# Altium schematic sheet 02.Revision History.SchDoc
size 297 x 209 mm; Revision: V2.1; Schematic Page Number: 11; Page Number: 3; Check: Default; Schematic Name: RK_NVR_DEMO1_RK3588_LP4/4x_V21; Page Count: 43; Page name: 02.Revision History; Designer: Zhangdz; Schematic Page Count: 99; Revcode: V2.1; DsnPath: E:\Work\SBER\RK3588_SOM\temp\RK_NVR_DEMO1_RK3588_LP4XD200P232SD8_V21_20211228.DSN; SchematicName: RK_NVR_DEMO1_RK3588_LP4/4x_V21; PageName: 02.Revision History; PageSize: A4; TopSchematic: True
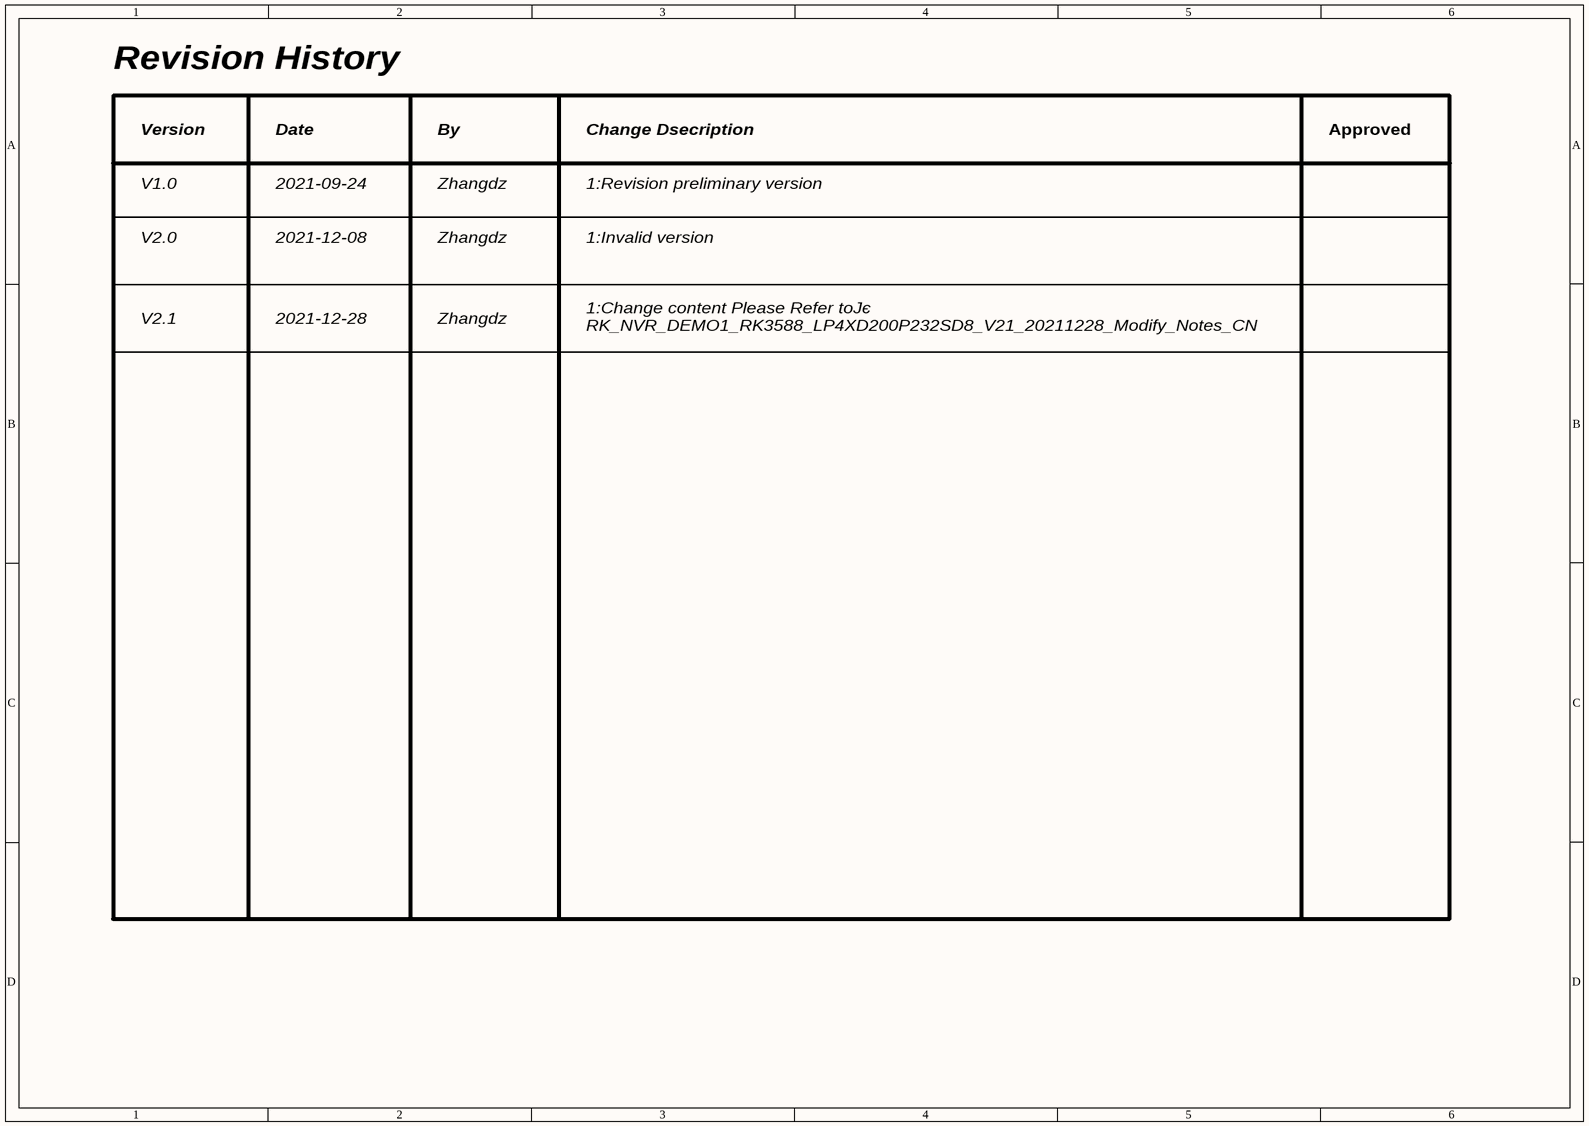
[diagram p0: 02.Revision History.SchDoc]

## Notes on the sheet
- Revision History
- Version
- Date
- By
- Change Dsecription
- Approved
- V1.0
- 2021-09-24
- Zhangdz
- 1:Revision preliminary version
- V2.0
- 2021-12-08
- 1:Invalid version
- V2.1
- 2021-12-28
- 1:Change content Please Refer toЈє
  RK_NVR_DEMO1_RK3588_LP4XD200P232SD8_V21_20211228_Modify_Notes_CN